# EAGLE design Adafruit Feather Zero BLE rev B (EAGLE 8.2.2)
COMPANY: ADAFRUIT INDUSTRIES; DRAWN: KTOWN; REV: B
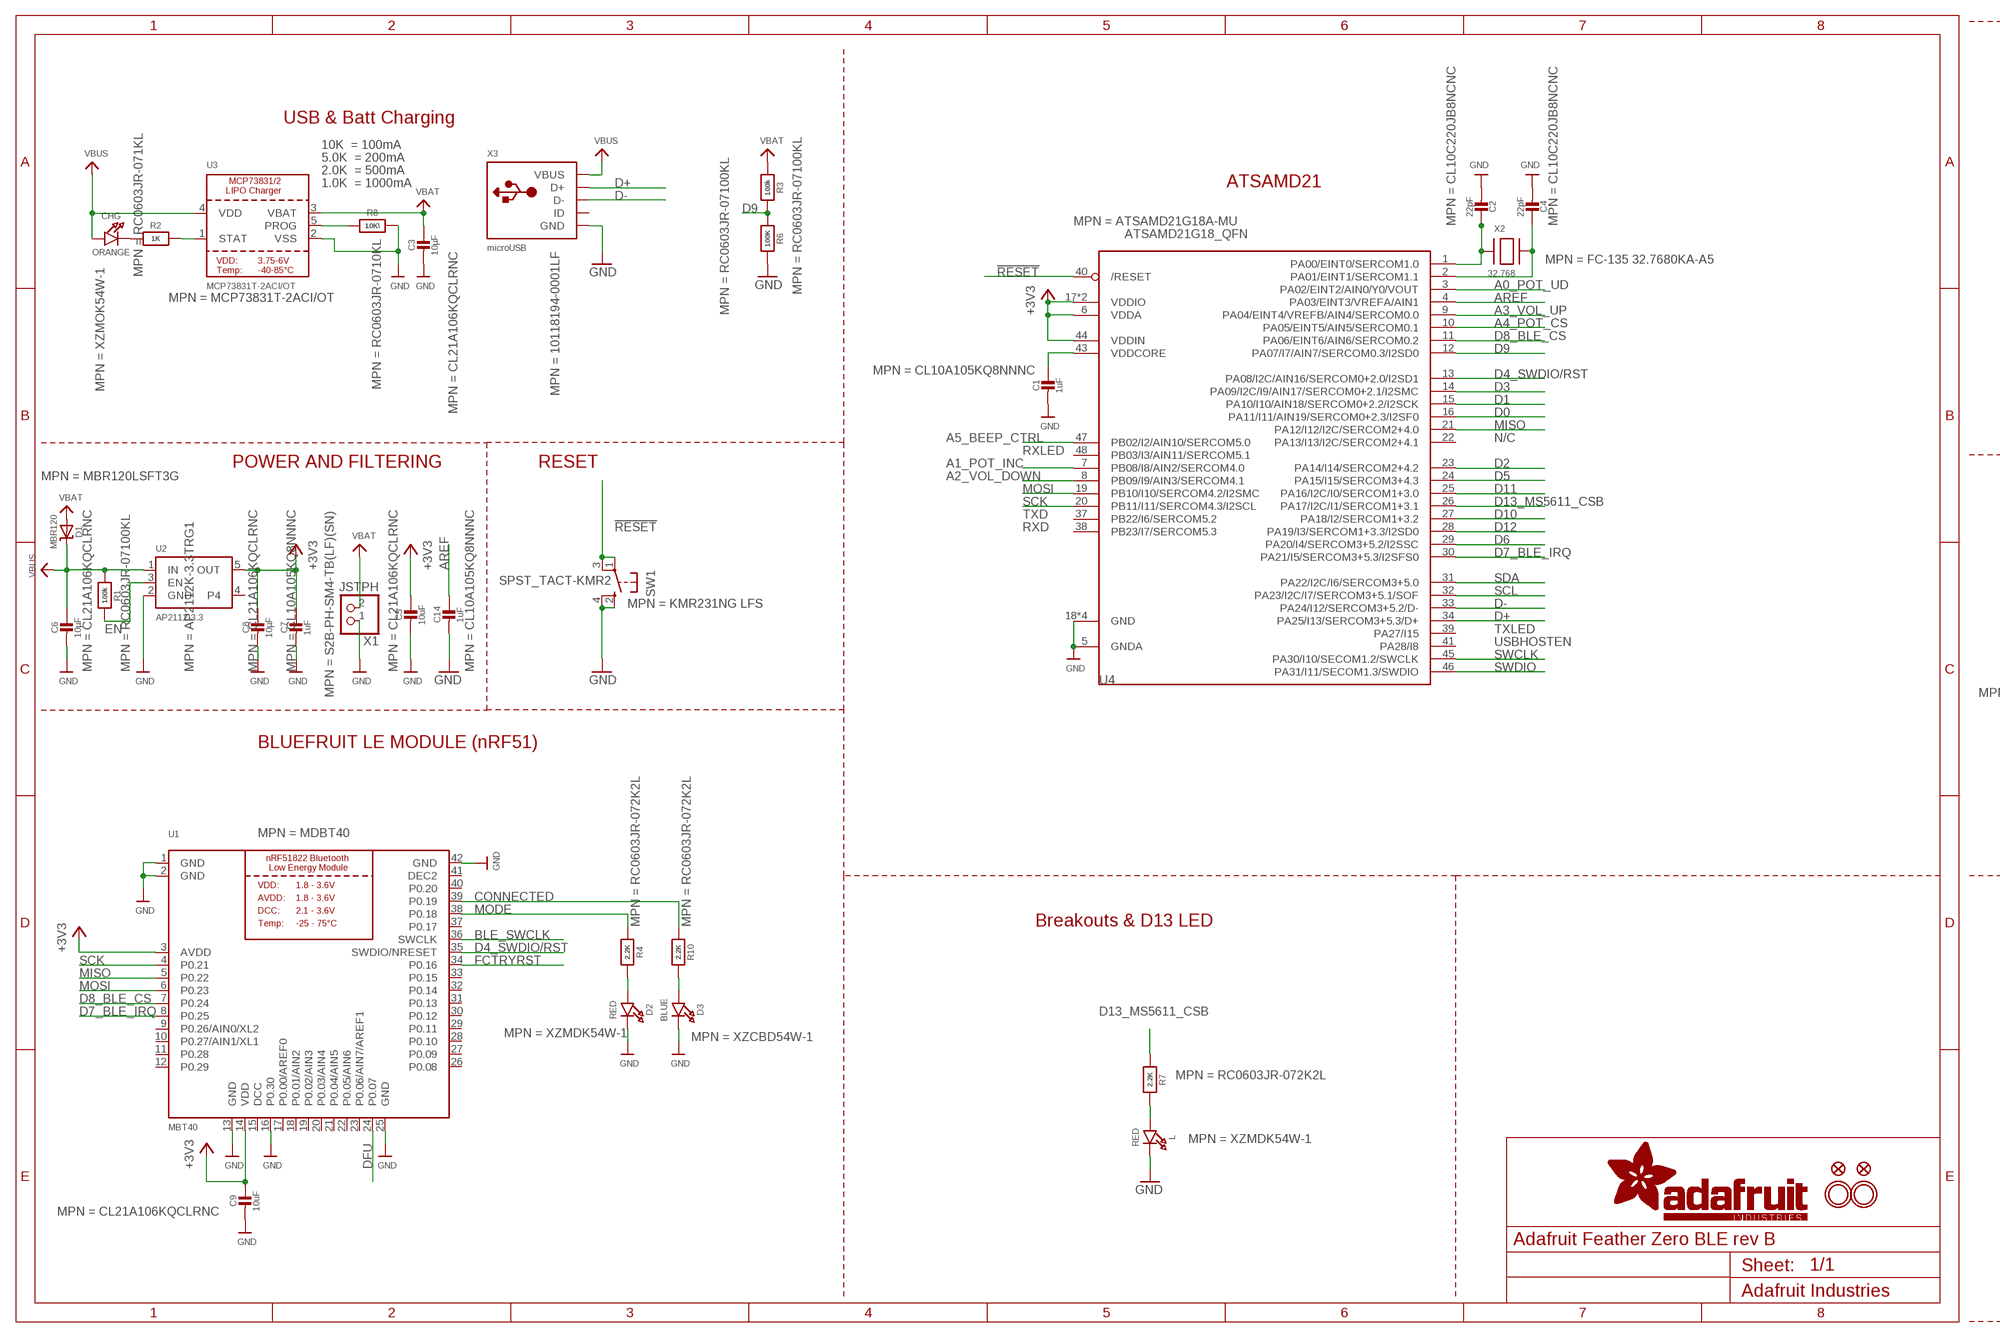
[diagram p0: schematic, sheet 1, part 1 of 2]
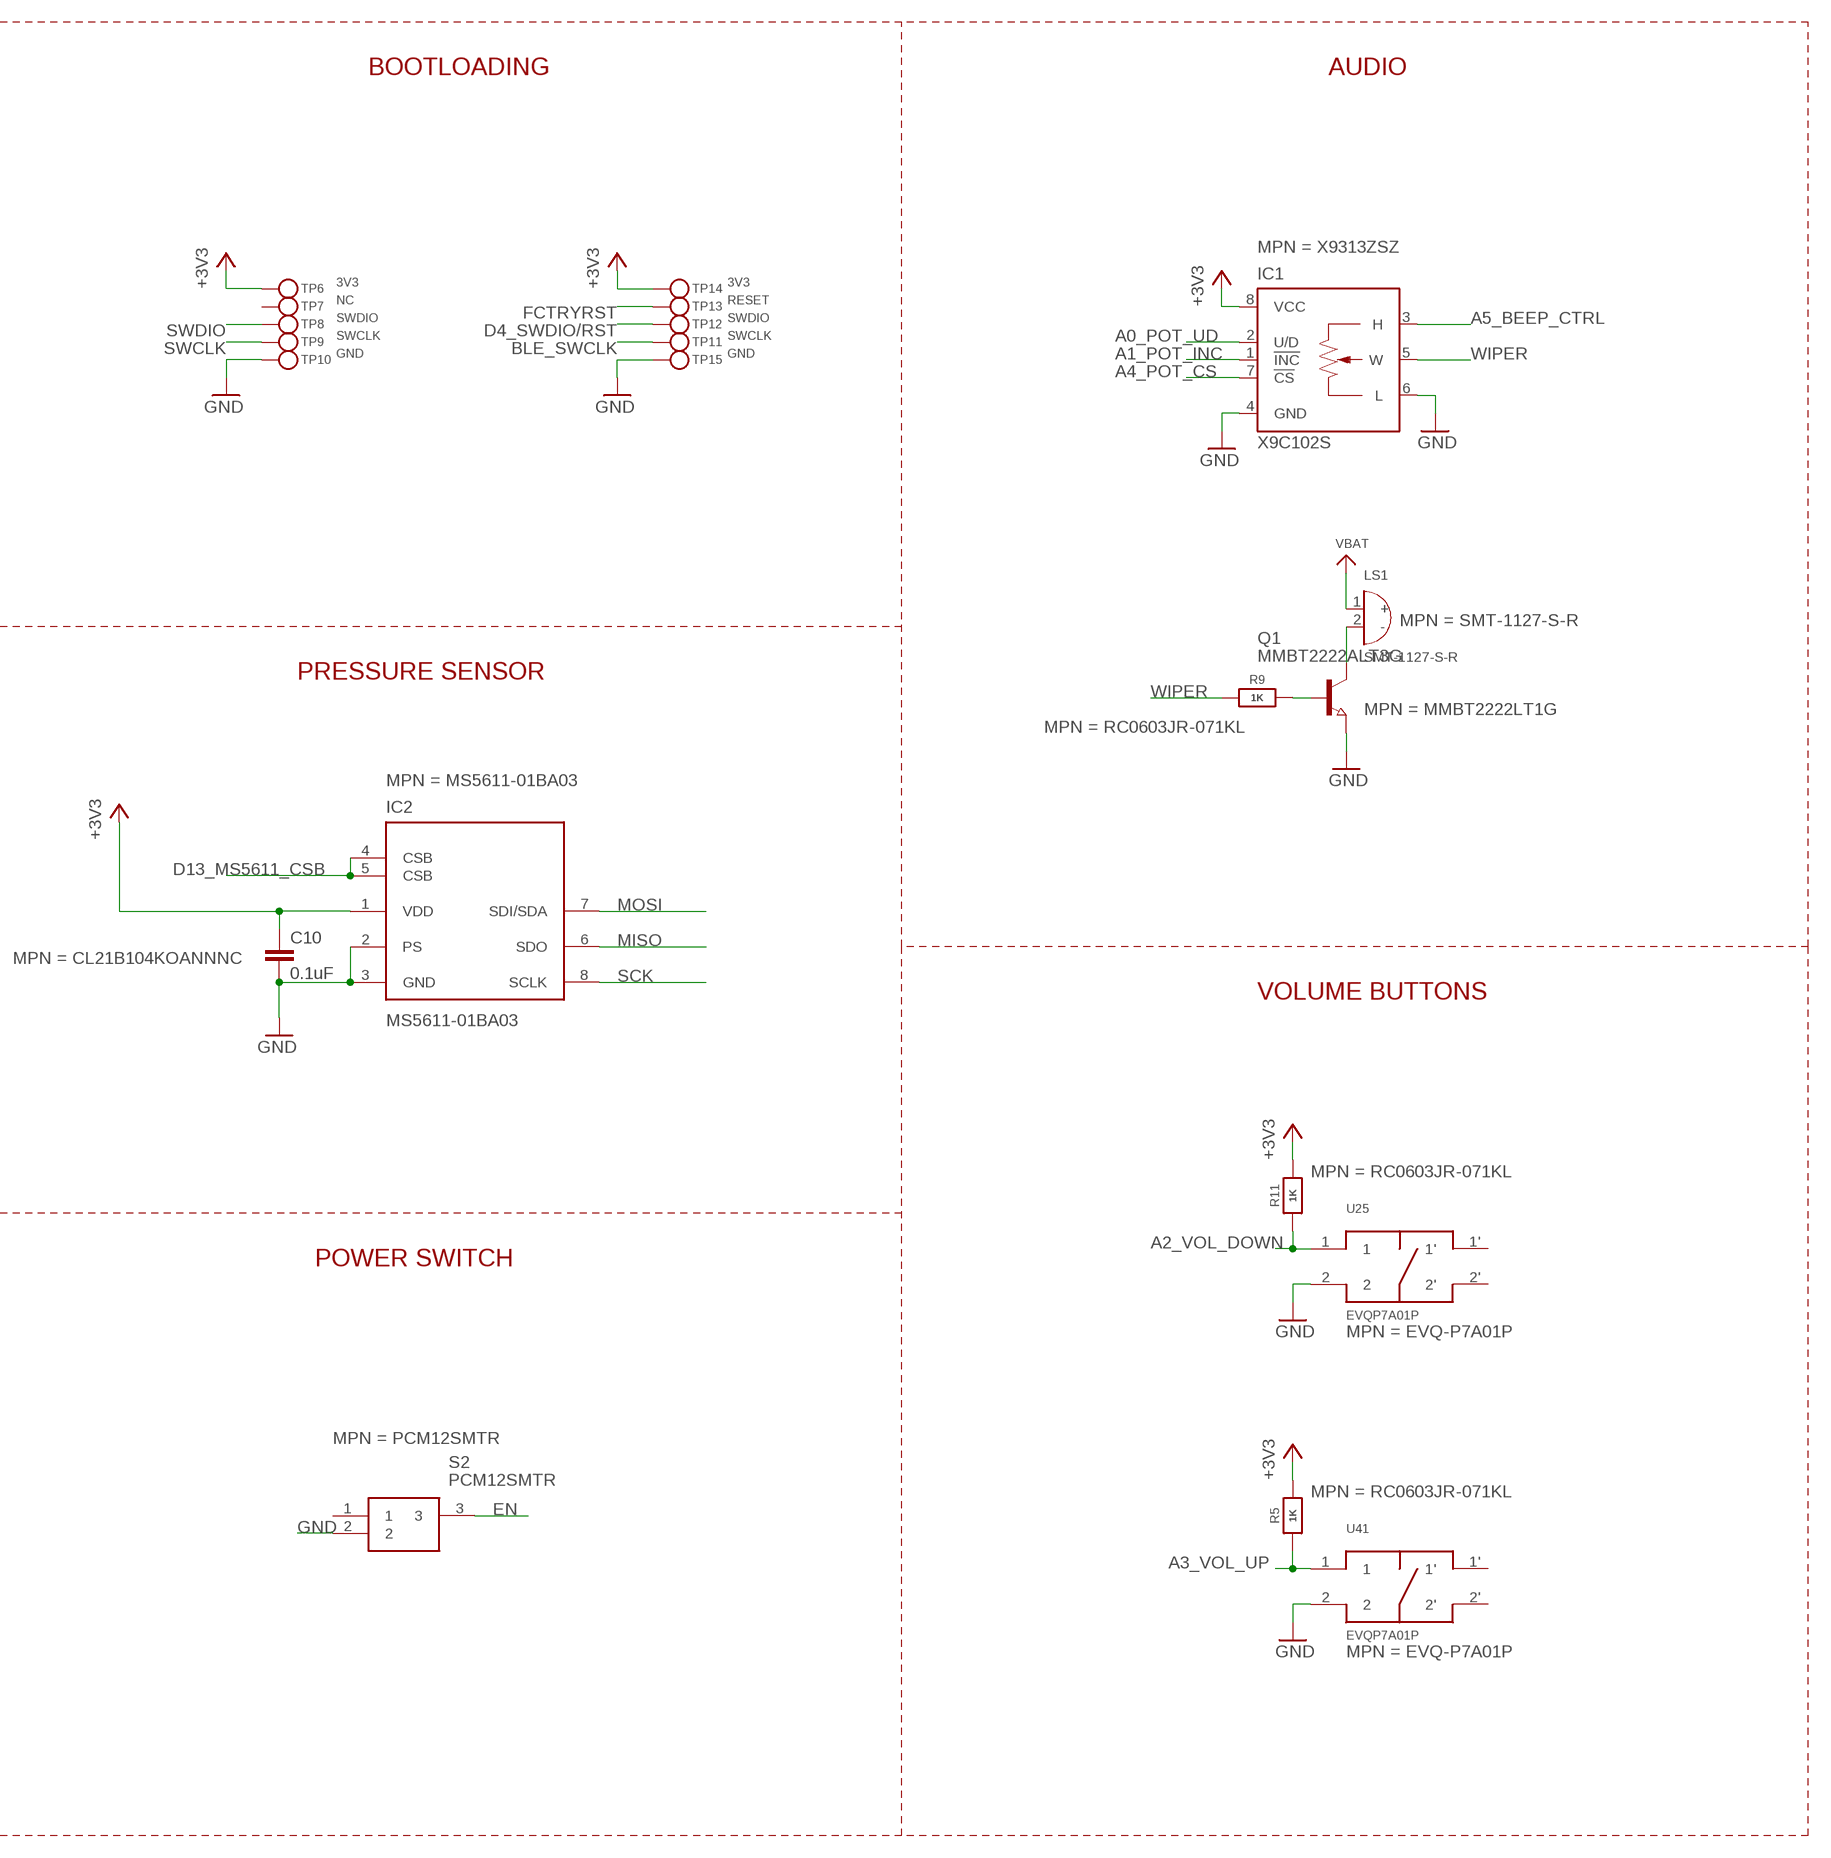
[diagram p1: schematic, sheet 1, part 2 of 2]

## Parts
C1  1uF  CAP_CERAMIC0603_NO  [0603-NO]
C2  22pF  CAP_CERAMIC0603_NO  [0603-NO]
C3  10µF  CAP_CERAMIC0805-NOOUTLINE  [0805-NO]
C4  22pF  CAP_CERAMIC0603_NO  [0603-NO]
C5  10uF  CAP_CERAMIC0805-NOOUTLINE  [0805-NO]
C6  10µF  CAP_CERAMIC0805-NOOUTLINE  [0805-NO]
C7  1uF  CAP_CERAMIC0603_NO  [0603-NO]
C8  10µF  CAP_CERAMIC0805-NOOUTLINE  [0805-NO]
C9  10uF  CAP_CERAMIC0805-NOOUTLINE  [0805-NO]
C10  0.1uF  C-EUC0805K  [C0805K]
C14  1uF  CAP_CERAMIC0603_NO  [0603-NO]
CHG  ORANGE  LED0805_NOOUTLINE  [CHIPLED_0805_NOOUTLINE]
D1  MBR120  DIODE-SCHOTTKYSOD-123  [SOD-123]
D2  RED  LED0805_NOOUTLINE  [CHIPLED_0805_NOOUTLINE]
D3  BLUE  LED0805_NOOUTLINE  [CHIPLED_0805_NOOUTLINE]
IC1  X9C102S  [SOIC08]
IC2  MS5611-01BA03  MS5611-01BA03UNO  [SON125P300X500X100-8N]
L  RED  LED0805_NOOUTLINE  [CHIPLED_0805_NOOUTLINE]
LS1  SMT-1127-S-R  [XDCR_SMT-1127-S-R]
Q1  MMBT2222ALT3G  NPN-TRANSISTOR_SOT23  [SOT23]
R1  100k  RESISTOR_0603_NOOUT  [0603-NO]
R2  1K  RESISTOR_0603_NOOUT  [0603-NO]
R3  100k  RESISTOR_0603_NOOUT  [0603-NO]
R4  2.2K  RESISTOR_0603_NOOUT  [0603-NO]
R5  1K  RESISTOR_0603_NOOUT  [0603-NO]
R6  100K  RESISTOR_0603_NOOUT  [0603-NO]
R7  2.2K  RESISTOR_0603_NOOUT  [0603-NO]
R8  10K\  RESISTOR_0603_NOOUT  [0603-NO]
R9  1K  RESISTOR_0603_NOOUT  [0603-NO]
R10  2.2K  RESISTOR_0603_NOOUT  [0603-NO]
R11  1K  RESISTOR_0603_NOOUT  [0603-NO]
S2  PCM12SMTR  [PCM12SMTR_1]
SW1  SPST_TACT-KMR2  [KMR2]
TP6  3V3  TESTPOINT1.5X2.0MM_NOCREAM  [PAD-1.5X2.0]
TP7  NC  TESTPOINT1.5X2.0MM_NOCREAM  [PAD-1.5X2.0]
TP8  SWDIO  TESTPOINT1.5X2.0MM_NOCREAM  [PAD-1.5X2.0]
TP9  SWCLK  TESTPOINT1.5X2.0MM_NOCREAM  [PAD-1.5X2.0]
TP10  GND  TESTPOINT1.5X2.0MM_NOCREAM  [PAD-1.5X2.0]
TP11  SWCLK  TESTPOINT1.5X2.0MM_NOCREAM  [PAD-1.5X2.0]
TP12  SWDIO  TESTPOINT1.5X2.0MM_NOCREAM  [PAD-1.5X2.0]
TP13  RESET  TESTPOINT1.5X2.0MM_NOCREAM  [PAD-1.5X2.0]
TP14  3V3  TESTPOINT1.5X2.0MM_NOCREAM  [PAD-1.5X2.0]
TP15  GND  TESTPOINT1.5X2.0MM_NOCREAM  [PAD-1.5X2.0]
U1  MBT40  NRF51822_MODULE_MDBT40  [BLE_MODULE_RAYTAC_MDBT40]
U2  AP2112-3.3  VREG_SOT23-5  [SOT23-5]
U3  MCP73831T-2ACI/OT  MCP73831/2  [SOT23-5]
U4  ATSAMD21G18_QFN  ATSAMD21J_QFN  [TQFN48_7MM]
U25  EVQP7A01P  [EVQP7A01P]
U41  EVQP7A01P  [EVQP7A01P]
U$31  MOUNTINGHOLE2.5  [MOUNTINGHOLE_2.5_PLATED]
U$32  MOUNTINGHOLE2.5  [MOUNTINGHOLE_2.5_PLATED]
U$34  FIDUCIAL""  [FIDUCIAL_1MM]
U$35  FIDUCIAL""  [FIDUCIAL_1MM]
X1  JSTPH  CON_JST_PH_2PIN  [JSTPH2]
X2  32.768  XTAL-3.2X1.5  [XTAL3215]
X3  microUSB  USB_MICRO_20329_V2  [4UCONN_20329_V2]

## Nets
!RESET: SW1.1(P) SW1.3(P1) U4.40(/RESET)
+3V3: C5.1 C7.1 C8.1 C9.1 C10.1 IC1.8(VCC) IC2.1(VDD) R5.2 R11.2 TP6.P$1 TP14.P$1 U1.3(AVDD) U1.14(VDD) U2.5(OUT) U4.6(VDDA) U4.17(VDDIO) U4.36(VDDIO) U4.44(VDDIN)
A0_POT_UD: IC1.2(U/D) U4.3(PA02/EINT2/AIN0/Y0/VOUT)
A1_POT_INC: IC1.1(!INC) U4.7(PB08/I8/AIN2/SERCOM4.0)
A2_VOL_DOWN: R11.1 U4.8(PB09/I9/AIN3/SERCOM4.1) U25.1
A3_VOL_UP: R5.1 U4.9(PA04/EINT4/VREFB/AIN4/SERCOM0.0) U41.1
A4_POT_CS: IC1.7(!CS) U4.10(PA05/EINT5/AIN5/SERCOM0.1)
A5_BEEP_CTRL: IC1.3(H) U4.47(PB02/I2/AIN10/SERCOM5.0)
AREF: C14.1 U4.4(PA03/EINT3/VREFA/AIN1)
BLE_SWCLK: TP11.P$1 U1.36(SWCLK)
CONNECTED: R10.1 U1.39(P0.19)
D0: U4.16(PA11/I11/AIN19/SERCOM0+2.3/I2SF0)
D1: U4.15(PA10/I10/AIN18/SERCOM0+2.2/I2SCK)
D2: U4.23(PA14/I14/SERCOM2+4.2)
D3: U4.14(PA09/I2C/I9/AIN17/SERCOM0+2.1/I2SMC)
D4_SWDIO/RST: TP12.P$1 U1.35(SWDIO/NRESET) U4.13(PA08/I2C/AIN16/SERCOM0+2.0/I2SD1)
D5: U4.24(PA15/I15/SERCOM3+4.3)
D6: U4.29(PA20/I4/SERCOM3+5.2/I2SSC)
D7_BLE_IRQ: U1.8(P0.25) U4.30(PA21/I5/SERCOM3+5.3/I2SFS0)
D8_BLE_CS: U1.7(P0.24) U4.11(PA06/EINT6/AIN6/SERCOM0.2)
D9: R3.2 R6.1 U4.12(PA07/I7/AIN7/SERCOM0.3/I2SD0)
D10: U4.27(PA18/I2/SERCOM1+3.2)
D11: U4.25(PA16/I2C/I0/SERCOM1+3.0)
D12: U4.28(PA19/I3/SERCOM1+3.3/I2SD0)
D13_MS5611_CSB: IC2.4(CSB) IC2.5(CSB) R7.1 U4.26(PA17/I2C/I1/SERCOM1+3.1)
D+: U4.34(PA25/I13/SERCOM3+5.3/D+) X3.D+
D-: U4.33(PA24/I12/SERCOM3+5.2/D-) X3.D-
DFU: U1.24(P0.07)
EN: R1.2 S2.3 U2.3(EN)
FCTRYRST: TP13.P$1 U1.34(P0.16)
GND: C1.2 C2.2 C3.2 C4.2 C5.2 C6.2 C7.2 C8.2 C9.2 C10.2 C14.2 D2.C D3.C IC1.4(GND) IC1.6(L) IC2.2(PS) IC2.3(GND) L.C Q1.2(E) R6.2 R8.2 S2.2 SW1.2(S) SW1.4(S1) TP10.P$1 TP15.P$1 U1.1(GND) U1.2(GND) U1.13(GND) U1.16(P0.30) U1.25(GND) U1.42(GND) U2.2(GND) U3.2(VSS) U4.5(GNDA) U4.18(GND) U4.35(GND) U4.42(GND) U4.THERMAL(GND) U25.2 U41.2 X1.1 X3.BASE@1(GND) X3.BASE@2(GND) X3.GND X3.SPRT@1(GND) X3.SPRT@2(GND) X3.SPRT@3(GND) X3.SPRT@4(GND)
MISO: IC2.6(SDO) U1.5(P0.22) U4.21(PA12/I12/I2C/SERCOM2+4.0)
MODE: R4.1 U1.38(P0.18)
MOSI: IC2.7(SDI/SDA) U1.6(P0.23) U4.19(PB10/I10/SERCOM4.2/I2SMC)
N$1: CHG.C R2.1
N$2: L.A R7.2
N$3: R2.2 U3.1(STAT)
N$4: R8.1 U3.5(PROG)
N$5: C2.1 U4.1(PA00/EINT0/SERCOM1.0) X2.P$1
N$6: D2.A R4.2
N$7: C4.1 U4.2(PA01/EINT1/SERCOM1.1) X2.P$2
N$8: D3.A R10.2
N$9: Q1.1(B) R9.2
N$10: LS1.2(-) Q1.3(C)
SCK: IC2.8(SCLK) U1.4(P0.21) U4.20(PB11/I11/SERCOM4.3/I2SCL)
SCL: U4.32(PA23/I2C/I7/SERCOM3+5.1/SOF)
SDA: U4.31(PA22/I2C/I6/SERCOM3+5.0)
SWCLK: TP9.P$1 U4.45(PA30/I10/SECOM1.2/SWCLK)
SWDIO: TP8.P$1 U4.46(PA31/I11/SECOM1.3/SWDIO)
VBAT: C3.1 D1.A LS1.1(+) R3.1 U3.3(VBAT) X1.2
VBUS: C6.1 CHG.A D1.C R1.1 U2.1(IN) U3.4(VDD) X3.VBUS
VDDCORE: C1.1 U4.43(VDDCORE)
WIPER: IC1.5(W) R9.1
Unconnected: S2.1 TP7.P$1 U1.9(P0.26/AIN0/XL2) U1.10(P0.27/AIN1/XL1) U1.11(P0.28) U1.12(P0.29) U1.17(P0.00/AREF0) U1.18(P0.01/AIN2) U1.19(P0.02/AIN3) U1.20(P0.03/AIN4) U1.21(P0.04/AIN5) U1.22(P0.05/AIN6) U1.23(P0.06/AIN7/AREF1) U1.26(P0.08) U1.27(P0.09) U1.28(P0.10) U1.29(P0.11) U1.30(P0.12) U1.31(P0.13) U1.32(P0.14) U1.33(P0.15) U1.37(P0.17) U1.40(P0.20) U2.4 U4.22(PA13/I13/I2C/SERCOM2+4.1) U4.37(PB22/I6/SERCOM5.2) U4.38(PB23/I7/SERCOM5.3) U4.39(PA27/I15) U4.41(PA28/I8) U4.48(PB03/I3/AIN11/SERCOM5.1) U25.1' U25.2' U41.1' U41.2' X3.ID

## Notes on the sheet
- BOOTLOADING | AUDIO
- USB & Batt Charging
- 10K  = 100mA
- 5.0K  = 200mA
- 2.0K  = 500mA
- 1.0K  = 1000mA | ATSAMD21
- N/C
- RXLED
- POWER AND FILTERING | RESET
- PRESSURE SENSOR
- TXD
- RXD
- TXLED
- USBHOSTEN
- VOLUME BUTTONS
- BLUEFRUIT LE MODULE (nRF51)
- POWER SWITCH
- Breakouts & D13 LED

## Power pins joined to a net without a drawn wire
DCC: U1.15(DCC)
DEC2: U1.41(DEC2)

## Library data of the parts
C1 C7 C14 = microbuilder:CAP_CERAMIC: Ceramic Capacitors For new designs, use the packages preceded by an '_' character since they are more reliable: The following footprints should be used on most boards: _0402 - Standard footprint for regular board layouts _0603 - Standard footprint for regular board layouts _0805 - Standard footprint for regular board layouts _1206 - Standard footprint for regular board layouts For extremely tight-pitch boards where space is at a premium, the following 'micro-pitch' footprints can be used (smaller pads, no silkscreen outline, etc.): _0402MP - Micro-pitch footprint for very dense/compact boards _0603MP - Micro-pitch footprint for very dense/compact boards _0805MP - Micro-pitch footprint for very dense/compact boards _1206MP - Micro-pitch footprint for very dense/compact boards; MPN: CL10A105KQ8NNNC
C2 C4 = microbuilder:CAP_CERAMIC: Ceramic Capacitors For new designs, use the packages preceded by an '_' character since they are more reliable: The following footprints should be used on most boards: _0402 - Standard footprint for regular board layouts _0603 - Standard footprint for regular board layouts _0805 - Standard footprint for regular board layouts _1206 - Standard footprint for regular board layouts For extremely tight-pitch boards where space is at a premium, the following 'micro-pitch' footprints can be used (smaller pads, no silkscreen outline, etc.): _0402MP - Micro-pitch footprint for very dense/compact boards _0603MP - Micro-pitch footprint for very dense/compact boards _0805MP - Micro-pitch footprint for very dense/compact boards _1206MP - Micro-pitch footprint for very dense/compact boards; MPN: CL10C220JB8NCNC
C3 C5 C6 C8 C9 = microbuilder:CAP_CERAMIC: Ceramic Capacitors For new designs, use the packages preceded by an '_' character since they are more reliable: The following footprints should be used on most boards: _0402 - Standard footprint for regular board layouts _0603 - Standard footprint for regular board layouts _0805 - Standard footprint for regular board layouts _1206 - Standard footprint for regular board layouts For extremely tight-pitch boards where space is at a premium, the following 'micro-pitch' footprints can be used (smaller pads, no silkscreen outline, etc.): _0402MP - Micro-pitch footprint for very dense/compact boards _0603MP - Micro-pitch footprint for very dense/compact boards _0805MP - Micro-pitch footprint for very dense/compact boards _1206MP - Micro-pitch footprint for very dense/compact boards; MPN: CL21A106KQCLRNC
C10 = rcl:C-EU: CAPACITOR, European symbol; MPN: CL21B104KOANNNC
CHG = microbuilder:LED: LED 0603 - 0603 Surface Mount Package 2mA: Green LED - Low Power (3.9mcd, 2ma, 1.7Vf) - Digikey: 475-2709-2-ND Orange LED - Low Power (9.8mcd, 2ma, 1.8Vf) - Digikey: 475-1194-2-ND Red LED - Low Power (5mcd, 2ma, 1.8Vf) - Digikey: 475-1195-2-ND Yellow LED - Low Power (7mcd, 2ma, 1.8Vf) - Digikey: 475-1196-2-ND 5mA: Blue LED - Low Power (17mcd, 5ma, 2.9Vf) - Digikey: LNJ937W8CRACT-ND 0805 - 0805 Surface Mount Package 2mA: Red LED (8.8mcd, 2mA, 1.8Vf, Clear) - Low Power [Digikey: 475-2510-1-ND] Green LED (5mcd, 2mA, 1.8Vf, Clear) - Low Power [Digikey: 475-2730-1-ND] Yellow LED (11.3mcd, 2mA, 1.8Vf, Clear) - Low Power [Digikey: 475-2555-1-ND] 20mA: Red LED (104mcd, 20mA, Diffused) - LS R976 [Digikey: 475-1278-6-ND] Red LED (12mcd, 20mA, 2.0Vf, Clear) - APT2012EC [Digikey: 754-1128-1-ND] Green LED (15mcd, 20mA, 2.2Vf, Clear) - APT2012GC [Digikey: 754-1131-1-ND] Orange LED (160mcd, 20mA, 2.1Vf, Clear) - APT2012SECK [Digikey: 754-1130-1-ND] 1206 - 1206 Surface Mount Package Green LED (26mcd, 20mA, Diffused) - LG N971 [Digikey: 475-1407-6-ND] Red LED (15mcd, 20mA, Diffused) - LH N974 [Digikey: 475-1416-6-ND] Cree - Cree High-Power Surface Mount LEDs XPEBWT-L1-0000-00D50 - White 111lm 350mA 2.9Vf 6200K 110° XTEAWT-00-0000-00000LEE3 - White 114lm 350mA 2.85Vf 5000K 115° Everlight - Everlight 45-21 Series Surface Mount LEDs 45-21/QK2C-B2832AC2CB2/2T - Warm White 2000mcd 20mA 3.25Vf 3050K 120° 45-21/LK2C-B38452C4CB2/2T - Nuetral White 2000mcd 20mA 3.25Vf 4150K 120° 45-21/LK2C-B50634C6CB2/2T - Cold White 2200mcd 20mA 3.25Vf 5650K 120° PLCC2 Reverse Mount LS T77K-J1L2-1-0-2-R18-Z - Red 11.25mcd 2mA 1.8Vf 630nm 120° LO T77K-L1M2-24-Z - Orange 19.6mcd 2mA 1.8Vf 606nm 120° LY T77K-K2M1-26-Z - Yellow 15.7mcd 2mA 1.8Vf 587nm 120°; MPN: XZMOK54W-1
D1 = microbuilder:DIODE-SCHOTTKY; MPN: MBR120LSFT3G
D2 L = microbuilder:LED: LED 0603 - 0603 Surface Mount Package 2mA: Green LED - Low Power (3.9mcd, 2ma, 1.7Vf) - Digikey: 475-2709-2-ND Orange LED - Low Power (9.8mcd, 2ma, 1.8Vf) - Digikey: 475-1194-2-ND Red LED - Low Power (5mcd, 2ma, 1.8Vf) - Digikey: 475-1195-2-ND Yellow LED - Low Power (7mcd, 2ma, 1.8Vf) - Digikey: 475-1196-2-ND 5mA: Blue LED - Low Power (17mcd, 5ma, 2.9Vf) - Digikey: LNJ937W8CRACT-ND 0805 - 0805 Surface Mount Package 2mA: Red LED (8.8mcd, 2mA, 1.8Vf, Clear) - Low Power [Digikey: 475-2510-1-ND] Green LED (5mcd, 2mA, 1.8Vf, Clear) - Low Power [Digikey: 475-2730-1-ND] Yellow LED (11.3mcd, 2mA, 1.8Vf, Clear) - Low Power [Digikey: 475-2555-1-ND] 20mA: Red LED (104mcd, 20mA, Diffused) - LS R976 [Digikey: 475-1278-6-ND] Red LED (12mcd, 20mA, 2.0Vf, Clear) - APT2012EC [Digikey: 754-1128-1-ND] Green LED (15mcd, 20mA, 2.2Vf, Clear) - APT2012GC [Digikey: 754-1131-1-ND] Orange LED (160mcd, 20mA, 2.1Vf, Clear) - APT2012SECK [Digikey: 754-1130-1-ND] 1206 - 1206 Surface Mount Package Green LED (26mcd, 20mA, Diffused) - LG N971 [Digikey: 475-1407-6-ND] Red LED (15mcd, 20mA, Diffused) - LH N974 [Digikey: 475-1416-6-ND] Cree - Cree High-Power Surface Mount LEDs XPEBWT-L1-0000-00D50 - White 111lm 350mA 2.9Vf 6200K 110° XTEAWT-00-0000-00000LEE3 - White 114lm 350mA 2.85Vf 5000K 115° Everlight - Everlight 45-21 Series Surface Mount LEDs 45-21/QK2C-B2832AC2CB2/2T - Warm White 2000mcd 20mA 3.25Vf 3050K 120° 45-21/LK2C-B38452C4CB2/2T - Nuetral White 2000mcd 20mA 3.25Vf 4150K 120° 45-21/LK2C-B50634C6CB2/2T - Cold White 2200mcd 20mA 3.25Vf 5650K 120° PLCC2 Reverse Mount LS T77K-J1L2-1-0-2-R18-Z - Red 11.25mcd 2mA 1.8Vf 630nm 120° LO T77K-L1M2-24-Z - Orange 19.6mcd 2mA 1.8Vf 606nm 120° LY T77K-K2M1-26-Z - Yellow 15.7mcd 2mA 1.8Vf 587nm 120°; MPN: XZMDK54W-1
D3 = microbuilder:LED: LED 0603 - 0603 Surface Mount Package 2mA: Green LED - Low Power (3.9mcd, 2ma, 1.7Vf) - Digikey: 475-2709-2-ND Orange LED - Low Power (9.8mcd, 2ma, 1.8Vf) - Digikey: 475-1194-2-ND Red LED - Low Power (5mcd, 2ma, 1.8Vf) - Digikey: 475-1195-2-ND Yellow LED - Low Power (7mcd, 2ma, 1.8Vf) - Digikey: 475-1196-2-ND 5mA: Blue LED - Low Power (17mcd, 5ma, 2.9Vf) - Digikey: LNJ937W8CRACT-ND 0805 - 0805 Surface Mount Package 2mA: Red LED (8.8mcd, 2mA, 1.8Vf, Clear) - Low Power [Digikey: 475-2510-1-ND] Green LED (5mcd, 2mA, 1.8Vf, Clear) - Low Power [Digikey: 475-2730-1-ND] Yellow LED (11.3mcd, 2mA, 1.8Vf, Clear) - Low Power [Digikey: 475-2555-1-ND] 20mA: Red LED (104mcd, 20mA, Diffused) - LS R976 [Digikey: 475-1278-6-ND] Red LED (12mcd, 20mA, 2.0Vf, Clear) - APT2012EC [Digikey: 754-1128-1-ND] Green LED (15mcd, 20mA, 2.2Vf, Clear) - APT2012GC [Digikey: 754-1131-1-ND] Orange LED (160mcd, 20mA, 2.1Vf, Clear) - APT2012SECK [Digikey: 754-1130-1-ND] 1206 - 1206 Surface Mount Package Green LED (26mcd, 20mA, Diffused) - LG N971 [Digikey: 475-1407-6-ND] Red LED (15mcd, 20mA, Diffused) - LH N974 [Digikey: 475-1416-6-ND] Cree - Cree High-Power Surface Mount LEDs XPEBWT-L1-0000-00D50 - White 111lm 350mA 2.9Vf 6200K 110° XTEAWT-00-0000-00000LEE3 - White 114lm 350mA 2.85Vf 5000K 115° Everlight - Everlight 45-21 Series Surface Mount LEDs 45-21/QK2C-B2832AC2CB2/2T - Warm White 2000mcd 20mA 3.25Vf 3050K 120° 45-21/LK2C-B38452C4CB2/2T - Nuetral White 2000mcd 20mA 3.25Vf 4150K 120° 45-21/LK2C-B50634C6CB2/2T - Cold White 2200mcd 20mA 3.25Vf 5650K 120° PLCC2 Reverse Mount LS T77K-J1L2-1-0-2-R18-Z - Red 11.25mcd 2mA 1.8Vf 630nm 120° LO T77K-L1M2-24-Z - Orange 19.6mcd 2mA 1.8Vf 606nm 120° LY T77K-K2M1-26-Z - Yellow 15.7mcd 2mA 1.8Vf 587nm 120°; MPN: XZCBD54W-1
IC1 = pot-xicor:X9C102*: Digital POTENTIOMETER; MF: INTERSIL; MPN: X9313ZSZ; OC_FARNELL: 1562072; OC_NEWARK: 79K8947
IC2 = Measurement-Specialties:MS5611-01BA03: Variometer Module, with stainless steel cap; MPN: MS5611-01BA03
LS1 = SMT-1127-S-R:SMT-1127-S-R: Audio Indicator Transducer Electromagnetic 3.6Vpk 100mA Solder Pad 2.5Vpk 2231Hz to 3231Hz Surface Mount; AVAILABILITY: Good; DESCRIPTION: Black Passive Electromagnetic SMD Buzzer 3V 80mA 2700Hz 92dB 9x3.2mm; MF: PUI Audio; MP: BOT-03D-BUJEON, SMT-1127-S-R; MPN: SMT-1127-S-R; PACKAGE: None; PRICE: 1.43 USD
Q1 = semicon-smd-ipc:NPN-TRANSISTOR_: NPN TRANSISTOR; MPN: MMBT2222LT1G
R1 R3 R6 = microbuilder:RESISTOR: Resistors For new designs, use the packages preceded by an '_' character since they are more reliable: The following footprints should be used on most boards: _0402 - Standard footprint for regular board layouts _0603 - Standard footprint for regular board layouts _0805 - Standard footprint for regular board layouts _1206 - Standard footprint for regular board layouts For extremely tight-pitch boards where space is at a premium, the following 'micro-pitch' footprints can be used (smaller pads, no silkscreen outline, etc.): _0402MP - Micro-pitch footprint for very dense/compact boards _0603MP - Micro-pitch footprint for very dense/compact boards _0805MP - Micro-pitch footprint for very dense/compact boards _1206MP - Micro-pitch footprint for very dense/compact boards; MPN: RC0603JR-07100KL
R2 R5 R9 R11 = microbuilder:RESISTOR: Resistors For new designs, use the packages preceded by an '_' character since they are more reliable: The following footprints should be used on most boards: _0402 - Standard footprint for regular board layouts _0603 - Standard footprint for regular board layouts _0805 - Standard footprint for regular board layouts _1206 - Standard footprint for regular board layouts For extremely tight-pitch boards where space is at a premium, the following 'micro-pitch' footprints can be used (smaller pads, no silkscreen outline, etc.): _0402MP - Micro-pitch footprint for very dense/compact boards _0603MP - Micro-pitch footprint for very dense/compact boards _0805MP - Micro-pitch footprint for very dense/compact boards _1206MP - Micro-pitch footprint for very dense/compact boards; MPN: RC0603JR-071KL
R4 R7 R10 = microbuilder:RESISTOR: Resistors For new designs, use the packages preceded by an '_' character since they are more reliable: The following footprints should be used on most boards: _0402 - Standard footprint for regular board layouts _0603 - Standard footprint for regular board layouts _0805 - Standard footprint for regular board layouts _1206 - Standard footprint for regular board layouts For extremely tight-pitch boards where space is at a premium, the following 'micro-pitch' footprints can be used (smaller pads, no silkscreen outline, etc.): _0402MP - Micro-pitch footprint for very dense/compact boards _0603MP - Micro-pitch footprint for very dense/compact boards _0805MP - Micro-pitch footprint for very dense/compact boards _1206MP - Micro-pitch footprint for very dense/compact boards; MPN: RC0603JR-072K2L
R8 = microbuilder:RESISTOR: Resistors For new designs, use the packages preceded by an '_' character since they are more reliable: The following footprints should be used on most boards: _0402 - Standard footprint for regular board layouts _0603 - Standard footprint for regular board layouts _0805 - Standard footprint for regular board layouts _1206 - Standard footprint for regular board layouts For extremely tight-pitch boards where space is at a premium, the following 'micro-pitch' footprints can be used (smaller pads, no silkscreen outline, etc.): _0402MP - Micro-pitch footprint for very dense/compact boards _0603MP - Micro-pitch footprint for very dense/compact boards _0805MP - Micro-pitch footprint for very dense/compact boards _1206MP - Micro-pitch footprint for very dense/compact boards; MPN: RC0603JR-0710KL
S2 = PCM12SMTR:PCM12SMTR: C & K COMPONENTS - PCM12SMTR - SWITCH, SPDT, 0.3A, 6VDC, SMD Source: Datasheet <http://www.farnell.com/datasheets/1789487.pdf>; ALLIED_NUMBER: 70417448; ALLIED_PRICE/STOCK: http://www.alliedelec.com/c-k-components-pcm12smtr/70417448/; DESCRIPTION: C & K COMPONENTS - PCM12SMTR - SWITCH, SPDT, 0.3A, 6VDC, SMD; HEIGHT: mm; MANUFACTURER_NAME: C & K COMPONENTS; MANUFACTURER_PART_NUMBER: PCM12SMTR; MPN: PCM12SMTR; RS_PART_NUMBER: 7931721P; RS_PRICE/STOCK: http://uk.rs-online.com/web/p/products/7931721P
SW1 = adafruit:SPST_TACT: SMT 6mm switch, EVQQ2 series http://www.ladyada.net/library/eagle; MPN: KMR231NG LFS
TP6-TP15 = microbuilder:TESTPOINT: Test Point Various test points for characterisation and PCB testing TESTPOINT_SMT - Compact Surface Mount Test Point [Digikey: 5016KTR-ND]
U1 = microbuilder:NRF51822_MODULE_MDBT40: nRF51822 Bluetooth Low Energy Module; MPN: MDBT40
U2 = microbuilder:VREG_SOT23-5: SOT23-5 Fixed Voltage Regulators Part Current Out V Out V In V Dropout θJA (°C/W) TJ (°C) Digikey Part No. ADP121 150mA 3.3V 3.4-5.5V 0.09V @ 150mA -- -- ADP121-AUJZ33R7CT-ND ADP121 150mA 3.0V 3.1-5.5V 0.09V @ 150mA -- -- ADP121-AUJZ30R7CT-ND ADP122 300mA 3.3V 3.4-5.5V 0.085V @ 300mA -- -- ADP122AUJZ-3.3-R7CT-ND ADP1712 300mA 3.3V 3.5-5.5V 0.17V @ 300mA -- -- ADP1712AUJZ-3.3-R7TR-ND AP7311 (Low Cost) 150mA 3.3V 3.5-6V 0.15V @ 150mA -- -- AP7311-33WG-7DICT-ND LD39015M18R 150mA 1.8V 1.9V-5.5V 0.08V @ 100mA -- -- 497-6977-1-ND LP2985A-33DBVR 150mA 3.3V 3.3-16V 0.28V @ 150mA 206 150 296-18479-1-ND MCP1824T-3302E/OT 300mA 3.3V 3.5V-6V 0.2V @ 300mA -- -- MCP1824T-3302E/OTCT-ND MIC5205-2.5YM5 TR 150mA 2.5V 2.7-16V 0.165V @ 150mA -- -- 576-1257-2-ND MIC5205-3.0YM5 TR 150mA 3.0V 3.2V-16V 0.165V @ 150mA -- -- 576-1258-2-ND MIC5205-3.3YM5 TR 150mA 3.3V 3.5V-16V 0.165V @ 150mA -- -- 576-1259-2-ND TPS780330220 150mA 3.3V+2.2V 3.6-5.5V 250mV Max -- -- 296-23332-1-ND TDA3663/N1,135 100mA 3.3V 3.5-45V 0.18V @ 50mA -- -- 568-5343-1-ND Max operating temp can be calculated using θJA, TJ (max junction temperature), and power in watts. Set the "Maximum Ambient Temperature" until it reaches TJ ("Max Junction Temperature"), which is the absolute limit for safe use of the regulator: Heat Sink Temperature Calculator <http://www.daycounter.com/Calculators/Heat-Sink-Temperature-Calculator.phtml> For example, With 12V source into a 3.3V LP2985 and a 30mA load, we are dissipating (12V-3.3V) * 0.03A = 0.261W. With a θJA of 206 °C/W, a TJ of 150°C, and 261mW we can safely use the chip without a heat sink up to 75°C (=147.1°C Junction Temperature).; MPN: AP2112K-3.3TRG1
U3 = microbuilder:MCP73831/2: MCP73831/2 LIPO Charger VDD: 3.75 - 6V Temp -40 - 85°C Programmable Charge Rate: 15-500mA NOTE: STAT is a tri-state logic output on the MCP73831 and an open-drain output on the MCP73832. SOT23-5 with 4.2V output and tri-state logic on STAT = MCP73831T-2ACI/OT; MPN: MCP73831T-2ACI/OT
U4 = microbuilder:ATSAMD21J; MPN: ATSAMD21G18A-MU
U25 U41 = EVQP7A01P:EVQP7A01P: EVQP7A01P Tactile Switch Surface Mount Right Angle; MPN: EVQ-P7A01P
U$31 U$32 = microbuilder:MOUNTINGHOLE: Mounting Hole For #2 screws (0.086"/2.18mm width, 0.094"/2.4mm hole) use 2.5mm; BOM: EXCLUDE
U$34 U$35 = microbuilder:FIDUCIAL: Fiducial Alignment Points Various fiducial points for machine vision alignment.; BOM: EXCLUDE
X1 = microbuilder:CON_JST_PH_2PIN: JST 2-Pin Right-Angle Connector PH-Series - 4UConnector: 17311 SH-Series - 4UConnector: 07278; MPN: S2B-PH-SM4-TB(LF)(SN)
X2 = adafruit2:XTAL: Low cost SMT crystals, no capacitors included http://www.ladyada.net/library/eagle; MPN: FC-135 32.7680KA-A5
X3 = microbuilder:USB: USB Connectors USBMINIB - Surface Mount Female Mini-B USB Connector 4UConnector: 06564; MPN: 10118194-0001LF

## Board
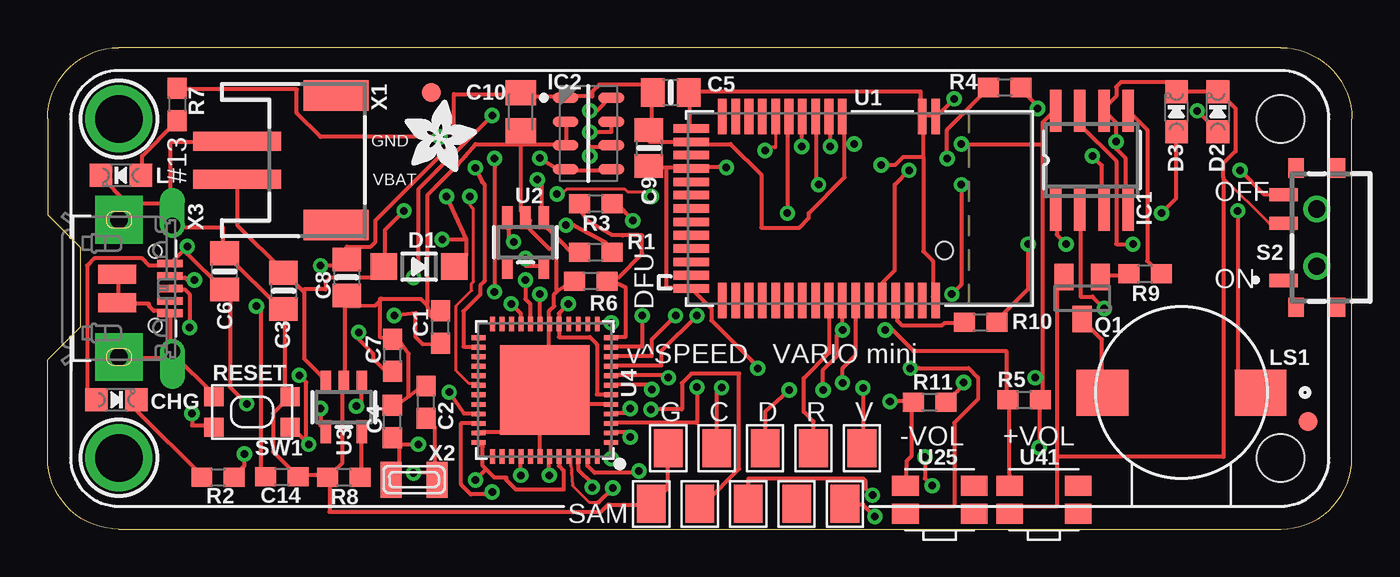
[diagram p2: board, top side]
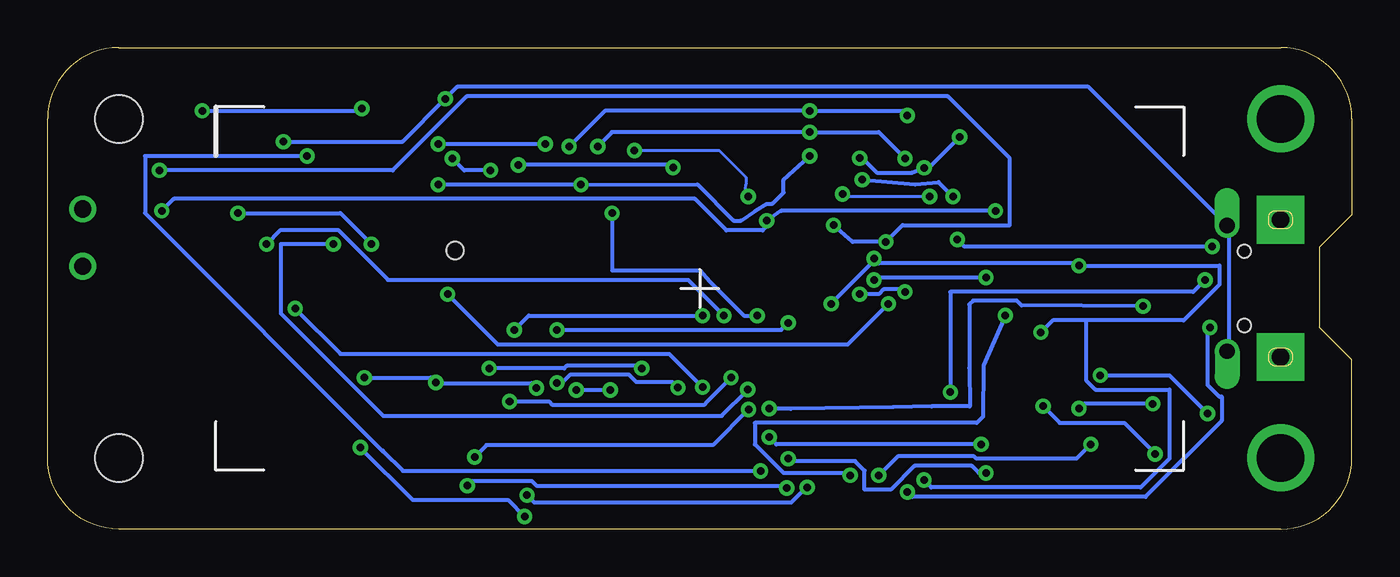
[diagram p3: board, bottom side, seen from below]

Size 68.44 x 25.26 mm. Coordinates in mm from the lower left corner, seen from the top.
Outline: 1.71,14.79 1.71,10.6 0,8.89 0,3.74 arc90 3.74,0 64.7,0 arc90 68.44,3.74 68.44,21.52 arc90 64.7,25.26 3.74,25.26 arc90 0,21.52 0,16.5 1.71,14.79
Copper layers (1*16): Top 0.035mm / dielectric 1.5mm / Bottom 0.035mm
Design rules "adafruit *": minimum track width 8mil, minimum drill 15.5mil, track to track 8mil, track to pad 8mil, pad to pad 8mil, via to via 8mil, smd to smd 8mil, copper to edge 10mil, drill to drill 8mil, minimum pad ring 10mil, minimum via ring 8mil, stop-mask expansion 2mil, vias tented up to drill 20mil, thermal gap 10mil
Holes 2.5 mm at 64.7,3.74 64.7,21.52

### Footprints (pad centres in the part's own frame; a part is rotated, then mirrored left to right if it is on the bottom)
0603-NO = smd 1.1 x 1: 1 -0.85,0; 2 0.85,0
0805-NO = smd 1.24 x 1.5: 1 -0.95,0; 2 0.95,0
C0805K = smd 1.3 x 1.6: 1 -1,0; 2 1,0
CHIPLED_0805_NOOUTLINE = smd 1.2 x 1.2: A 0,-1.05; C 0,1.05
SOD-123 = smd 1.4 x 1.4: A 1.85,0; C -1.85,0
SOIC08 = smd 0.6 x 2.2: 1 -1.905,-2.6; 2 -0.635,-2.6; 3 0.635,-2.6; 4 1.905,-2.6; 5 1.905,2.6; 6 0.635,2.6; 7 -0.635,2.6; 8 -1.905,2.6
SON125P300X500X100-8N = smd 1.35 x 0.55: 1 -1.2,1.875; 2 -1.2,0.625; 3 -1.2,-0.625; 4 -1.2,-1.875; 5 1.2,-1.875; 6 1.2,-0.625; 7 1.2,0.625; 8 1.2,1.875
XDCR_SMT-1127-S-R = smd 2.71 x 2.41: 1 -4.15,0; 2 4.15,0
SOT23 = smd 1 x 1.4: 1 -0.95,-1.1; 2 0.95,-1.1; 3 0,1.1
PCM12SMTR_1 = smd 0.7 x 1.5: 1 -2.25,1.75; 2 0.75,1.75; 3 2.25,1.75 | smd 1 x 0.8: 4 -3.65,1.1; 5 -3.65,-1.1; 6 3.65,1.1; 7 3.65,-1.1 | drill 0.9 pad 1.4: 8 -1.5,0; 9 1.5,0
KMR2 = smd 1 x 1: 1 2,0.8; 2 2,-0.8; 3 -2,0.8; 4 -2,-0.8
PAD-1.5X2.0 = smd 1.5 x 2: P$1 0,0
BLE_MODULE_RAYTAC_MDBT40 = smd 1.85 x 0.45: 1 -4.825,4; 2 -4.825,3.3; 3 -4.825,-0.9; 4 -4.825,-1.6; 5 -4.825,-2.3; 6 -4.825,-3; 7 -4.825,-3.7; 8 -4.825,-4.4; 9 -4.825,-5.1; 10 -4.825,-5.8; 11 -4.825,-6.5; 12 -4.825,-7.2; 26 4.825,-7.2; 27 4.825,-6.5; 28 4.825,-5.8; 29 4.825,-5.1; 30 4.825,-4.4; 31 4.825,-3.7; 32 4.825,-3; 33 4.825,-2.3; 34 4.825,-1.6; 35 4.825,-0.9; 36 4.825,-0.2; 37 4.825,0.5; 38 4.825,1.2; 39 4.825,1.9; 40 4.825,2.6; 41 4.825,3.3; 42 4.825,4 | smd 0.45 x 1.85: 13 -4.2,-8.825; 14 -3.5,-8.825; 15 -2.8,-8.825; 16 -2.1,-8.825; 17 -1.4,-8.825; 18 -0.7,-8.825; 19 0,-8.825; 20 0.7,-8.825; 21 1.4,-8.825; 22 2.1,-8.825; 23 2.8,-8.825; 24 3.5,-8.825; 25 4.2,-8.825 | hole 0.9: 2.2,4.45
SOT23-5 = smd 0.55 x 1.2: 1 -0.95,-1.3; 2 0,-1.3; 3 0.95,-1.3; 4 0.95,1.3; 5 -0.95,1.3
TQFN48_7MM = smd 0.25 x 0.75: 1 -2.75,-3.475; 2 -2.25,-3.475; 3 -1.75,-3.475; 4 -1.25,-3.475; 5 -0.75,-3.475; 6 -0.25,-3.475; 7 0.25,-3.475; 8 0.75,-3.475; 9 1.25,-3.475; 10 1.75,-3.475; 11 2.25,-3.475; 12 2.75,-3.475; 25 2.75,3.475; 26 2.25,3.475; 27 1.75,3.475; 28 1.25,3.475; 29 0.75,3.475; 30 0.25,3.475; 31 -0.25,3.475; 32 -0.75,3.475; 33 -1.25,3.475; 34 -1.75,3.475; 35 -2.25,3.475; 36 -2.75,3.475 | smd 0.75 x 0.25: 13 3.475,-2.75; 14 3.475,-2.25; 15 3.475,-1.75; 16 3.475,-1.25; 17 3.475,-0.75; 18 3.475,-0.25; 19 3.475,0.25; 20 3.475,0.75; 21 3.475,1.25; 22 3.475,1.75; 23 3.475,2.25; 24 3.475,2.75; 37 -3.475,2.75; 38 -3.475,2.25; 39 -3.475,1.75; 40 -3.475,1.25; 41 -3.475,0.75; 42 -3.475,0.25; 43 -3.475,-0.25; 44 -3.475,-0.75; 45 -3.475,-1.25; 46 -3.475,-1.75; 47 -3.475,-2.25; 48 -3.475,-2.75 | smd 4.7 x 4.7: THERMAL 0,0
EVQP7A01P = smd 1.4 x 1.05: 1 0,1.45; 1' 3.6,1.45; 2 0,0; 2' 3.6,0
MOUNTINGHOLE_2.5_PLATED = drill 2.5 pad 3.2: P$1 0,0
FIDUCIAL_1MM = smd 1 x 1: 1 0,0
JSTPH2 = smd 1 x 4.6: 1 -1,-3.7; 2 1,-3.7 | smd 1.6 x 3.4: NC1 -3.4,1.5; NC2 3.4,1.5
XTAL3215 = smd 1.1 x 1.9: P$1 1.2,0; P$2 -1.2,0
4UCONN_20329_V2 = smd 1 x 2: BASE@1 -0.75,-2; BASE@2 0.75,-2 | smd 0.4 x 1.35: D+ 0,0.775; D- -0.65,0.775; GND 1.3,0.775; ID 0.65,0.775; VBUS -1.3,0.775 | drill 0.8 pad 1.2 offset: SPRT@1 -3.3,0.9; SPRT@2 3.3,0.9 | drill 0.9 pad 2.5 square: SPRT@3 -3.6,-1.9; SPRT@4 3.6,-1.9 | hole 0.7: -1.95,0; 1.95,0

### Placement (x,y rotation side)
C1  20.63,10.6 90 top
C2  19.87,6.66 90 top
C3  12.38,12.5 270 top
C4  18.09,5.65 90 top
C5  32.7,22.92 0 top
C6  9.29,13.52 90 top
C7  18.11,9.12 90 top
C8  15.69,13.21 270 top
C9  31.55,20 270 top
C10  24.82,21.9 270 top
C14  12.3,2.75 0 top
CHG  3.61,6.79 270 top
D1  19.49,13.77 180 top
D2  61.4,21.9 0 top
D3  59.24,21.9 0 top
IC1  54.79,19.36 0 top
IC2  28.38,20.76 0 top
L  3.84,18.56 90 top
LS1  59.49,7.17 180 top
Q1  54.29,12.12 180 top
R1  28.76,14.54 0 top
R2  8.95,2.72 0 top
R3  28.76,17.07 180 top
R4  50.22,23.17 0 top
R5  51.24,6.79 0 top
R6  28.5,13.01 180 top
R7  6.79,22.28 270 top
R8  15.55,2.72 180 top
R9  57.59,13.39 180 top
R10  48.95,10.85 0 top
R11  46.28,6.66 0 top
S2  66.6,15.3 90 top
SW1  10.72,6.15 180 top
TP6  41.84,1.33 0 top
TP7  39.3,1.33 0 top
TP8  36.76,1.33 0 top
TP9  34.22,1.33 0 top
TP10  31.68,1.33 0 top
TP11  35.11,4.25 0 top
TP12  37.65,4.25 0 top
TP13  40.19,4.25 0 top
TP14  42.73,4.25 0 top
TP15  32.57,4.25 0 top
U1  42.6,16.82 270 top
U2  25.08,15.04 180 top
U3  15.55,6.41 180 top
U4  26.09,7.3 90 top
U25  45.01,0.82 0 top
U41  50.48,0.82 0 top
U$7  [ADAFRUIT_3.5MM]  18.73,18.73 0 top
U$31  3.74,21.52 270 top
U$32  3.74,3.74 270 top
U$34  20.12,22.92 270 top
U$35  66.14,5.65 270 top
X1  13.65,19.36 270 top
X2  19.23,2.6 0 top
X3  5.65,12.63 270 top

### Tracks (layer width: path | path; a pad name or v marks a point on that pad's centre or on a via)
!RESET  (via drill 0.39)
  Top 0.203: v24.82,2.83 24.82,3.7 U4.40 | SW1.3 12.82,5.33 v13.7,4.45 13.57,4.7 13.57,7.7 v13.2,8.07 | v7.57,6.08 7.57,5.45 8.7,5.45 SW1.1
  Bottom 0.203: v24.82,2.83 23.82,3.83 19.82,3.83 19.7,3.7 14.45,3.7 v13.7,4.45 | v7.57,6.08 9.57,8.07 v13.2,8.07
+3V3  (via drill 0.39)
  Top 0.203: 47.07,6.7 R11.2 47.2,6.7 48.07,7.57 v48.07,7.7 | 52.2,20.2 52.2,21.32 52.82,21.95 IC1.8 | 52.2,20.2 52.2,7.95 | 52.2,7.95 52.2,6.82 R5.2 52.03,6.79 v52.03,4.29 | 52.2,7.95 v51.82,7.95 | 41.82,20.2 41.82,18.45 39.95,16.57 39.95,16.32 39.45,15.82 37.45,15.82 37.45,18.59 35.84,20.2 33.82,20.2 U1.14 33.7,20.32 31.57,20.32 31.57,20.82 C9.1 31.57,20.95 31.7,21.07 31.7,22.82 C5.1 31.7,22.95 31.7,23.32 28.95,23.32 28.57,22.95 28.57,22.7 27.2,22.7 IC2.1 27.07,22.7 24.82,22.7 24.82,22.82 C10.1 24.7,22.82 21.32,22.82 21.32,20.32 17.2,16.2 17.2,15.07 16.95,14.82 15.7,14.82 15.7,14.2 C8.1 15.57,14.07 15.57,13.82 v14.32,13.82 | 41.82,20.2 41.82,21.57 U1.3 | U4.6 29.45,7.07 28.82,7.07 28.82,9.7 28.45,10.07 26.82,10.07 26.82,10.7 U4.17 26.82,10.82 26.82,11.32 v27.32,11.82 | 23.01,3.14 23.45,2.7 24.07,2.7 24.07,2.58 24.57,2.08 27.07,2.08 27.07,3.08 26.82,3.33 26.82,3.7 U4.44 | 23.01,3.14 22.82,3.33 22.82,4.33 22.7,4.45 U4.36 | v16.32,10.32 16.32,9.95 17.07,9.2 17.07,8.95 17.71,8.31 18.32,8.32 C7.1 | v25.07,14.2 25.07,13.82 25.95,13.82 U2.5 | v22.45,2.58 23.01,3.14 | v47.95,20.2 52.2,20.2 | 41.82,20.2 v42.32,20.2 | v43.41,0.66 42.78,1.28 41.91,1.28 TP6.P$1 | v42.78,7.41 42.78,4.29 TP14.P$1
  Bottom 0.203: v51.82,7.95 48.32,7.95 v48.07,7.7 48.03,7.66 43.03,7.66 v42.78,7.41 | v16.32,10.32 15.7,10.95 13.95,10.95 | 13.95,10.95 8.82,10.95 6.95,12.82 6.95,13.82 v14.32,13.82 14.45,13.95 24.82,13.95 v25.07,14.2 25.07,14.07 v27.32,11.82 | v22.45,2.58 22.07,2.2 11.07,2.2 9.57,3.7 9.57,7.32 13.45,7.32 13.95,7.82 13.95,10.95 | v42.32,20.2 v47.95,20.2 | v43.41,0.66 44.28,1.53 49.28,1.53 v52.03,4.29
A0_POT_UD  (via drill 0.39)
  Top 0.203: v34.07,7.45 34.07,5.58 29.57,5.58 U4.3 | v55.45,11.57 54.82,12.2 54.2,12.2 54.2,16.7 IC1.2
  Bottom 0.203: v34.07,7.45 35.82,9.2 53.07,9.2 v55.45,11.57
A1_POT_INC  (via drill 0.39)
  Top 0.203: v31.7,7.32 31.7,7.57 29.57,7.57 U4.7 | v53.45,14.95 52.95,15.45 52.95,16.7 IC1.1
  Bottom 0.203: v31.7,7.32 33.07,5.95 50.82,5.95 56.2,11.32 56.2,14.95 v53.45,14.95
A2_VOL_DOWN  (via drill 0.39)
  Top 0.203: v32.57,7.95 32.57,8.07 29.57,8.07 U4.8 | v44.2,6.7 45.32,6.7 R11.1 45.32,6.58 45.32,3.83 45.07,3.58 U25.1
  Bottom 0.203: v32.57,7.95 33.82,6.7 33.97,6.53 41.97,6.53 42.13,6.7 v44.2,6.7
A3_VOL_UP  (via drill 0.39)
  Top 0.203: v34.07,11.2 32.2,9.32 32.2,8.57 29.57,8.57 U4.9 | v43.95,10.45 44.32,10.45 45.45,9.32 50.32,9.32 50.32,6.82 R5.1 50.45,6.7 50.45,3.58 U41.1
  Bottom 0.203: v34.07,11.2 43.2,11.2 v43.95,10.45
A4_POT_CS  (via drill 0.39)
  Top 0.203: v32.95,11.2 31.7,9.95 31.7,9.07 29.57,9.07 U4.10 | v56.95,14.95 56.07,14.95 56.07,19.32 54.2,21.2 54.2,21.95 IC1.7
  Bottom 0.203: v32.95,11.2 34.82,13.07 50.57,13.07 53.2,15.7 56.2,15.7 v56.95,14.95
A5_BEEP_CTRL  (via drill 0.39)
  Top 0.203: v31.03,3.06 31.02,3.06 30.79,2.95 28.7,2.95 28.32,3.33 28.32,3.7 U4.47 | v54.82,19.57 55.32,19.07 55.32,16.82 IC1.3
  Bottom 0.203: v31.03,3.06 49.79,3.06 50.86,4.12 50.82,4.08 63.33,16.57 63.33,19.57 v54.82,19.57
AREF  (via drill 0.39)
  Top 0.203: v30.57,6.33 30.57,6.08 29.57,6.08 U4.4 | v10.95,11.7 11.2,11.45 11.2,2.95 11.32,2.83 C14.1
  Bottom 0.203: v30.57,6.33 29.45,6.31 24.06,6.41 22.06,6.44 20.05,6.44 20.07,8.45 20.07,11.79 19.87,12 17.58,12 17.33,11.74 v10.95,11.7
BLE_SWCLK  (via drill 0.39)
  Top 0.203: U1.36 42.4,10.76 42.41,10.74 42.41,9.14 41.71,8.44 v41.71,7.68 | TP11.P$1 35.11,7.3 35.24,7.42 v35.36,7.42
  Bottom 0.203: v41.71,7.68 41.44,7.68 40.99,8.13 37.95,8.13 37.56,7.73 35.67,7.73 v35.36,7.42
CONNECTED
  Top 0.203: R10.1 48.07,10.82 47.07,10.82 46.95,10.7 44.83,10.7 44.7,10.82 44.57,10.95 44.57,11.95 U1.39
D4_SWDIO/RST  (via drill 0.39)
  Top 0.203: v29.57,10.82 28.95,10.82 U4.13 | U1.35 41.7,11.95 41.7,11.07 v41.71,10.45 41.41,10.15 41.41,9.08 40.7,8.37 v40.7,7.3 | TP12.P$1 37.66,4.29 37.65,6.15 v38.92,7.3
  Bottom 0.203: v29.57,10.82 29.95,10.45 v41.71,10.45 | v38.92,7.3 v40.7,7.3
D7_BLE_IRQ  (via drill 0.39)
  Top 0.152: U4.30 22.52,7.64 22.13,7.64 21.44,8.32 21.44,11.72 22.25,12.53 22.25,12.89 22.33,12.97 22.33,16.82 22.16,17 v22.16,17.46 | U1.8 38.2,20.04 | 38.2,20.04 38.16,20 | 38.2,20.04 37.82,20.04 v37.65,19.87 | v26.73,17.58 26.97,17.58 27.24,17.85 30.27,17.85 30.42,17.71 31.3,17.71 31.55,17.46 v31.68,17.46
  Bottom 0.152: v37.65,19.87 33.2,19.87 31.79,18.46 31.79,18.11 31.81,17.84 31.68,17.71 v31.68,17.46 | v22.16,17.46 26.6,17.46 v26.73,17.58
D8_BLE_CS  (via drill 0.39)
  Top 0.203: v31.2,11.2 31.2,9.57 29.57,9.57 U4.11 | v38.82,16.57 38.82,16.95 38.82,21.57 U1.7
  Bottom 0.203: v31.2,11.2 31.9,11.2 33.71,13.01 34.21,13.57 38.82,13.57 38.81,13.82 v38.81,16.57 v38.82,16.57
D9
  Top 0.203: U4.12 29.57,10.07 30.32,10.07 30.32,12.7 29.57,13.07 R6.1 29.95,13.2 31.2,14.45 31.2,15.41 30.17,15.41 29.65,15.42 28.32,16.17 27.57,17.32 R3.2
D13_MS5611_CSB  (via drill 0.39)
  Top 0.203: v22.45,18.96 22.79,18.22 22.92,18.09 22.92,13.01 22.7,12.79 22.7,12.31 21.82,11.44 21.82,9.57 22.57,9.57 U4.26 | v25.82,19.46 27.07,18.7 27.07,18.82 IC2.4 27.2,18.82 29.57,18.82 IC2.5 | v20.57,20.57 14.32,20.57 13.07,21.82 13.07,23.07 6.82,23.07 R7.1
  Bottom 0.203: v25.82,19.46 25.58,19.36 24.92,18.7 23.07,18.7 v22.45,18.96 22.32,18.83 v20.57,20.57
D+  (via drill 0.39)
  Top 0.203: v23.32,1.95 23.32,1.82 22.2,1.82 21.7,2.33 21.7,5.58 22.57,5.58 U4.34 | v7.45,10.57 7.45,12.32 7.2,12.57 6.45,12.57 X3.D+
  Bottom 0.203: v23.32,1.95 23.07,1.7 10.82,1.7 6.82,5.7 6.82,6.95 6.95,6.95 7.57,7.57 7.57,10.57 v7.45,10.57
D-  (via drill 0.39)
  Top 0.203: v21.07,7.19 21.83,6.08 22.57,6.08 U4.33 | v7.7,13.07 7.32,13.07 7.2,13.2 6.45,13.2 X3.D-
  Bottom 0.203: v21.07,7.19 21.07,12.45 8.32,12.45 v7.7,13.07
DFU
  Top 0.203: 33.82,13.32 U1.24
EN  (via drill 0.39)
  Top 0.203: v27.2,15.95 27.6,15.95 29.27,15.04 29.32,14.81 29.31,14.57 R1.2 | v24.45,15.07 24.2,15.32 24.2,16.32 U2.3 | v62.57,18.82 63.83,17.57 S2.3
  Bottom 0.203: v27.2,15.95 26.2,15.07 v24.45,15.07 23.57,15.95 17.95,15.95 17.95,19.45 21.2,22.7 46.45,22.7 50.32,18.82 v62.57,18.82
FCTRYRST
  Top 0.203: 40.95,12.07 U1.34 41,9.25 39.68,7.93 39.68,6.15 40.19,5.65 TP13.P$1
GND  (via drill 0.39)
  Top 0.152: X3.SPRT@3 3.75,16.73 4.14,17.13 | 6.45,9.45 6.03,9.03 X3.SPRT@4 | S2.2 64.1,16.05 61.7,18.45
  Top 0.203: U1.13 33.7,21.07 33.7,22.82 C5.2 33.7,22.95 45.82,22.95 45.82,21.7 U1.2 | U1.2 45.95,21.7 46.57,21.7 U1.1 46.7,21.7 v47.57,22.57 | 45.95,19.53 45.95,21.57 U1.2 | 45.95,19.53 45.95,14.57 46.45,14.07 46.45,12.2 46.57,12.07 U1.42 | 52.95,3.8 52.95,12.82 53.32,13.2 Q1.2 | 52.95,3.8 52.95,1.18 50.57,1.18 U41.2 | IC1.4 56.57,16.82 56.57,19.45 56.07,19.95 v56.07,20.32 56.07,21.32 55.45,21.95 IC1.6 55.45,22.07 56.07,22.7 56.07,23.2 56.32,23.45 59.2,23.45 59.2,23.07 D3.C 59.32,22.95 61.32,22.95 D2.C 61.45,22.95 62.32,22.07 62.32,19.82 61.7,19.2 61.7,18.45 61.7,3.8 52.95,3.8 | 64.95,15.95 65.09,16.08 S2.2 | U25.2 45.07,1.18 47.57,1.18 47.57,5.58 48.82,6.82 48.82,7.95 48.33,8.44 45.73,8.44 45.72,8.44 v45.27,8.44 | 32.45,18.95 33.7,18.95 U1.16 33.84,18.98 v35.62,18.98 | 32.45,18.95 31.57,18.95 C9.2 | 32.45,18.95 32.45,12.7 33.7,12.7 U1.25 33.82,12.57 34.82,11.57 34.82,10.95 36.95,8.82 37.27,8.51 v37.27,8.44 | IC2.2 27.2,21.32 27.2,20.2 IC2.3 27.07,20.2 24.82,20.2 | 24.82,20.2 24.82,20.82 C10.2 | 24.82,20.2 24.82,16.7 25.07,16.45 U2.2 25.2,16.32 25.32,16.2 25.32,15.7 26.32,14.7 26.7,14.7 26.7,12.57 26.76,12.51 | 25.82,5.08 25.82,6.95 26.07,7.2 U4.THERMAL | 25.82,5.08 25.82,3.83 U4.42 | 25.82,5.08 22.7,5.08 U4.35 | 25.82,5.08 U4.THERMAL | 26.32,6.58 26.07,6.58 U4.THERMAL | 26.32,6.58 29.45,6.58 U4.5 | 26.32,6.58 26.32,10.7 U4.18 26.32,10.82 26.32,11.45 26.57,11.7 26.57,12.32 26.76,12.51 | 26.32,6.58 U4.THERMAL | 26.76,12.51 27.57,13.07 R6.2 27.82,13.07 | 18.95,6.96 19.82,7.59 C2.2 | 18.95,6.96 18.45,6.58 C4.2 | 18.95,6.96 18.95,9.2 18.45,9.95 C7.2 17.43,10.07 17.43,12.08 17.54,12.08
  Top 0.203: 19.89,11.77 19.57,12.08 17.54,12.08 | 19.89,11.77 20.07,11.2 20.2,11.2 20.7,11.59 C1.2 | R8.2 14.7,2.83 13.2,2.83 C14.2 13.07,2.83 11.82,4.08 11.82,6.08 12.7,6.95 SW1.4 12.7,7.07 12.45,7.32 12.45,11.45 C3.2 12.32,11.45 9.32,14.45 C6.2 9.2,14.57 9.2,15.82 6.58,15.82 X3.SPRT@1 | 15.57,11.7 15.57,12.2 C8.2 15.57,11.7 | 15.57,11.7 15.57,7.82 U3.2 15.45,7.7 15.45,3.45 14.82,2.83 R8.2 | 15.57,11.7 17.2,11.74 17.54,12.08 | X3.BASE@1 3.7,13.32 3.7,11.95 X3.BASE@2 3.7,11.82 5.33,11.82 5.33,11.7 5.58,11.45 6.33,11.45 X3.GND 6.45,11.32 6.45,9.45 X3.SPRT@2 6.58,9.32 6.58,9.2 8.7,7.07 SW1.2 | 6.45,17.07 4.2,17.07 4.14,17.13 2.83,18.45 L.C | 6.45,17.07 6.45,15.95 X3.SPRT@1 | 6.45,17.07 6.45,20.32 9.82,20.32 X1.1 | 6.45,17.07 X3.SPRT@1 | 24.82,20.2 22.45,20.2 21.94,19.58 21.52,19.11 19.95,17.54 19.95,11.96 19.89,11.77 | TP15.P$1 32.53,4.16 32.53,2.16 31.79,1.41 TP10.P$1 31.66,1.28 29.41,1.28 29.04,0.91 14.79,0.91 14.79,2.66 R8.2 | v43.74,19.11 44.48,19.11 44.91,19.53 45.49,19.53 45.5,19.53 45.95,19.53
  Bottom 0.203: v56.07,20.32 49.82,20.32 v47.57,22.57 46.95,23.2 13.82,23.2 6.58,15.95 X3.SPRT@1 6.45,15.82 6.45,9.45 X3.SPRT@2 | v37.27,8.44 37.39,8.44 37.52,8.57 41.2,8.57 41.33,8.44 v45.27,8.44 | 35.95,19.11 v43.74,19.11 | 35.95,19.11 35.87,19.11 | v35.62,18.98 35.82,18.98 35.95,19.11
MISO  (via drill 0.39)
  Top 0.203: v24.32,11.82 24.82,11.32 24.82,10.82 U4.21 | v47.45,12.32 47.95,12.82 v47.95,18.07 | v40.45,18.07 40.32,18.2 40.32,21.57 U1.5 | v28.45,19.57 28.45,20.07 29.57,20.07 IC2.6
  Bottom 0.203: v24.32,11.82 26.45,9.7 44.82,9.7 v47.45,12.32 | v47.95,18.07 v40.45,18.07 34.35,18.09 32.44,16.19 32.06,16.19 31.3,16.69 30.68,17.06 30.41,17.07 29.82,17.66 29.82,18.33 v28.45,19.57
MODE  (via drill 0.39)
  Top 0.203: v47.2,19.45 47.2,20.95 49.32,23.07 R4.1 | v45.2,18.82 44.45,18.07 44.45,13.57 43.82,12.95 43.82,12.07 U1.38
  Bottom 0.203: v47.2,19.45 46.57,18.82 v45.2,18.82
MOSI  (via drill 0.39)
  Top 0.203: v25.82,12.32 25.82,10.82 U4.19 | v23.45,19.45 v23.45,12.45 | v28.45,20.82 29.57,20.82 29.57,21.32 IC2.7 | v39.57,20.07 39.57,21.57 U1.6
  Bottom 0.203: v25.82,12.32 24.82,12.32 24.57,12.57 23.57,12.57 v23.45,12.45 | v23.45,19.45 24.82,20.82 v28.45,20.82 38.82,20.82 v39.57,20.07
N$1
  Top 0.203: R2.1 8.07,2.83 4.7,6.2 4.7,6.7 CHG.C
N$2
  Top 0.203: R7.2 6.7,21.32 4.95,19.57 4.95,18.57 L.A
N$3  (via drill 0.39)
  Top 0.203: v10.32,3.95 10.32,3.33 9.82,2.83 R2.2 | v16.2,6.45 16.45,6.7 16.45,7.7 U3.1
  Bottom 0.203: v10.32,3.95 11.95,5.58 15.32,5.58 v16.2,6.45
N$4
  Top 0.203: R8.1 16.45,2.83 16.45,5.08 U3.5
N$5  (via drill 0.39)
  Top 0.203: v29.57,3.7 29.57,4.45 U4.1 | 20.32,2.95 v19.2,2.95 | 20.32,2.95 20.32,2.7 X2.P$1 20.32,2.95 | 20.32,2.95 20.32,5.08 20.32,5.33 C2.1
  Bottom 0.203: v29.57,3.7 29.45,3.58 26.07,3.58 25.57,3.08 25.57,2.08 24.2,2.08 22.95,3.33 19.95,3.33 19.57,2.95 v19.2,2.95
N$6  (via drill 0.39)
  Top 0.203: v51.95,22.07 51.95,22.2 51.07,23.07 R4.2 | v60.32,21.95 61.32,20.95 D2.A
  Bottom 0.203: v51.95,22.07 52.07,21.95 v60.32,21.95
N$7  (via drill 0.39)
  Top 0.203: v30.57,4.83 30.57,5.08 29.57,5.08 U4.2 | 18.45,4.45 v19.45,4.45 | 18.45,4.45 18.45,4.7 C4.1 18.45,4.45 | 18.45,4.45 18.45,3.08 18.07,2.7 X2.P$2
  Bottom 0.203: v30.57,4.83 30.2,4.45 v19.45,4.45
N$8  (via drill 0.39)
  Top 0.203: v51.45,14.95 51.45,12.57 49.82,10.95 R10.2 | v58.45,16.57 59.2,17.32 59.2,20.82 D3.A
  Bottom 0.203: v51.45,14.95 53.07,16.57 v58.45,16.57
N$9
  Top 0.203: R9.2 56.7,13.32 55.32,13.32 Q1.1
N$10
  Top 0.203: Q1.3 54.32,10.95 55.32,9.95 55.32,7.2 LS1.2
SCK  (via drill 0.39)
  Top 0.203: v25.07,13.07 25.07,12.07 25.32,11.82 25.32,10.82 U4.20 | v19.2,13.2 19.45,13.45 19.45,17.82 v23.32,21.7 | v28.45,21.95 28.82,21.95 29.57,22.7 IC2.8 | v41.07,20.07 41.07,21.57 U1.4
  Bottom 0.203: v25.07,13.07 24.95,13.2 v19.2,13.2 | v23.32,21.7 23.57,21.95 v28.45,21.95 39.2,21.95 v41.07,20.07
SWCLK  (via drill 0.39)
  Top 0.152: U4.45 27.43,3.82 27.44,3.68 27.43,3.6 27.44,3.58 27.44,3.33 27.47,3.29 27.49,3.09 27.49,2.95 27.54,2.29 28.42,1.41 28.87,1.41
  Top 0.203: v29.66,2.16 28.91,1.41 28.87,1.41 | v46.41,2.29 46.03,2.66 v46.03,3.79 | v31.66,6.29 33.28,6.29 33.28,7.66 33.78,8.16 36.28,8.16 36.28,3.16 34.53,1.41 34.28,1.41 TP9.P$1
  Bottom 0.203: v29.66,2.16 29.79,2.29 42.78,2.29 43.03,2.54 46.16,2.54 v46.41,2.29 | v46.03,3.79 45.41,4.41 33.53,4.41 v31.66,6.29
SWDIO  (via drill 0.39)
  Top 0.203: v28.59,2.2 28.59,2.39 27.87,3.11 27.82,3.7 U4.46 | v43.28,1.78 42.91,2.16 42.91,2.54 42.78,2.66 36.78,2.66 36.78,1.41 TP8.P$1
  Bottom 0.203: v43.28,1.78 42.91,1.41 29.41,1.41 28.66,2.16 v28.59,2.2
VBAT  (via drill 0.39)
  Top 0.203: 13.39,12.51 12.45,13.45 C3.1 12.32,13.57 9.95,15.95 9.95,18.32 X1.2 | 13.39,12.51 13.45,12.45 13.45,8.95 14.57,7.82 U3.3 | v30.7,16.18 29.71,17.33 R3.1 | v18.7,16.7 17.7,15.7 17.7,13.82 D1.A 17.57,13.7 17.57,13.2 14.82,13.2 14.57,12.95 14.57,12.57 13.45,12.57 13.39,12.51 | v62.45,16.7 62.45,8.32 63.58,7.2 LS1.1
  Bottom 0.203: v18.7,16.7 29.95,16.7 v30.7,16.18 30.7,16.05 30.7,15.89 30.92,15.68 32.82,15.68 34.47,17.33 61.82,17.32 v62.45,16.7
VBUS  (via drill 0.39)
  Top 0.203: v14.32,6.33 14.32,5.45 14.57,5.2 U3.4 | v10.45,6.58 9.57,7.45 9.57,12.2 9.32,12.45 C6.1 9.2,12.57 7.2,14.57 v7.32,14.82 6.45,13.95 X3.VBUS 6.33,13.82 5.33,13.82 4.95,14.2 2.45,14.2 2.08,13.82 2.08,7.2 2.45,6.82 CHG.A | R1.1 27.43,14.57 26.95,15.07 26.07,15.95 26.07,16.32 U2.1 25.95,16.45 25.95,18.2 25.96,18.22 v25.7,18.34 | v20.93,17.45 21.95,15.2 | 21.95,15.2 21.95,14.32 21.45,13.82 D1.C | v20.7,15.2 21.95,15.2
  Bottom 0.203: v14.32,6.33 14.07,6.58 v10.45,6.58 | v20.93,17.45 21.69,18.21 22.92,18.09 25.58,18.34 v25.7,18.34 | v20.7,15.2 20.32,14.82 v7.32,14.82
VDDCORE  (via drill 0.39)
  Top 0.203: v26.32,2.83 26.32,3.7 U4.43 | v18.18,11.2 19.32,11.34 19.32,10.08 19.69,9.71 C1.1
  Bottom 0.203: v26.32,2.83 26.45,2.95 29.82,2.95 31.32,4.45 31.32,5.58 19.68,5.58 19.36,5.9 19.32,8.57 v18.18,11.2
WIPER
  Top 0.203: R9.1 58.32,13.45 57.7,14.07 57.7,20.95 IC1.5

### Text on the board
tPlace: GND | #13 | VBAT | OFF | DFU | ON | v^SPEED | VARIO mini | RESET | G | C | D | R | V | -VOL | +VOL | SAM
tNames: SW1